# Altium schematic sheet measurment_iq.SchDoc
size A4; SheetNumber: 6; SheetTotal: 7
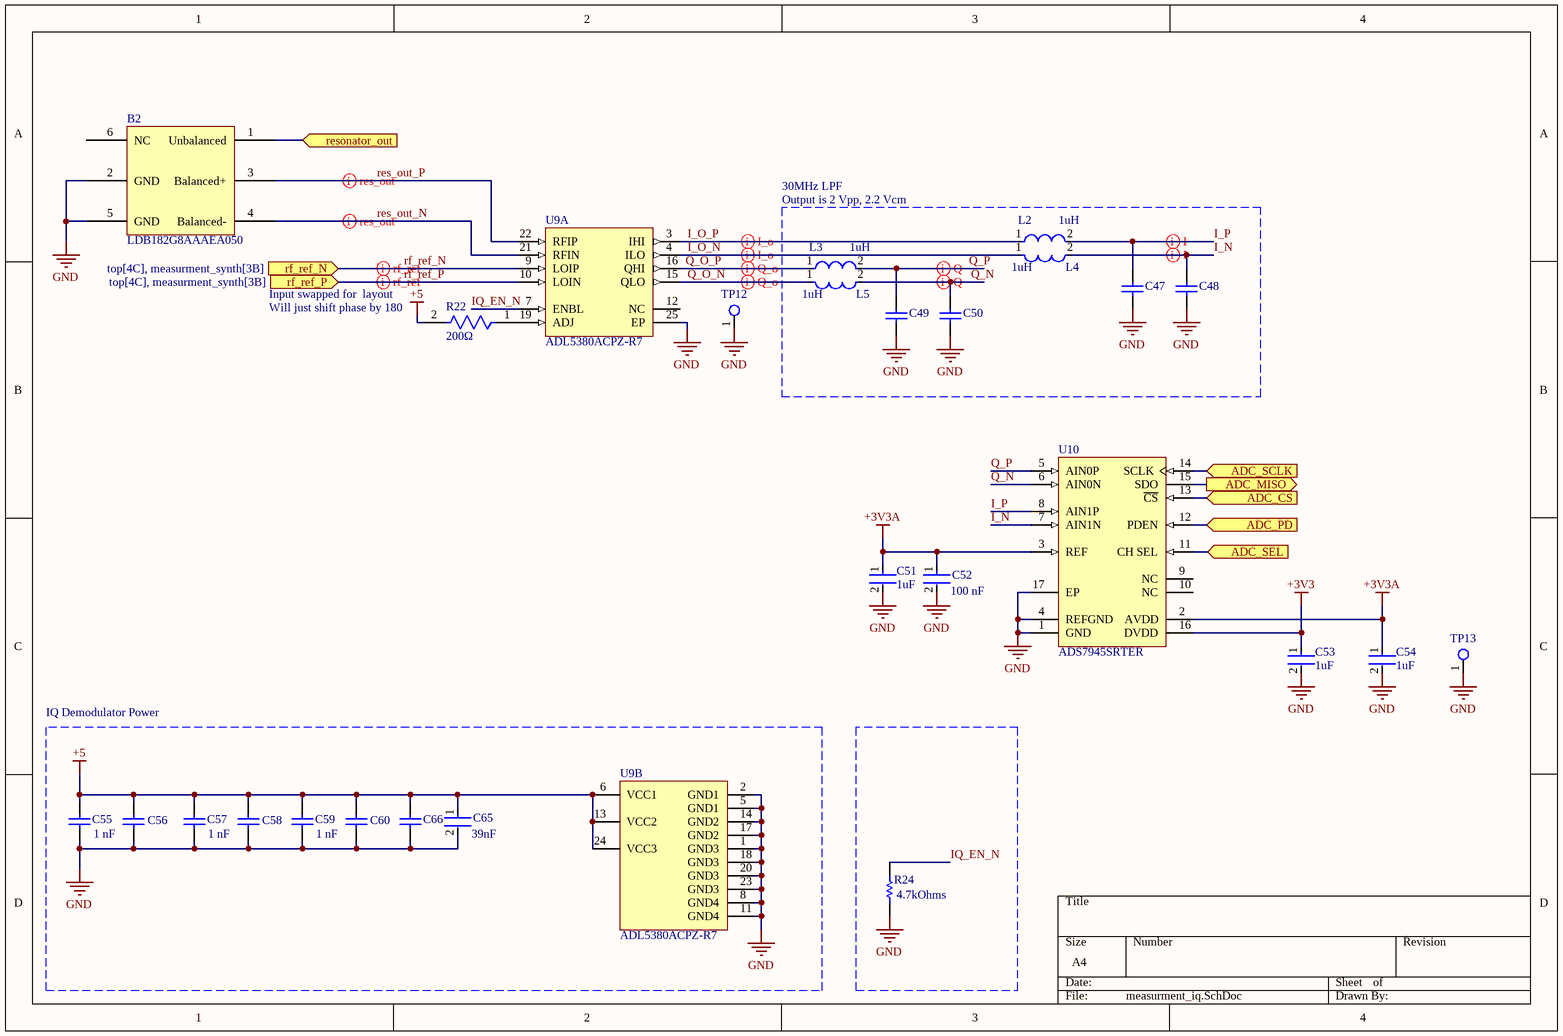
[diagram p0: measurment_iq.SchDoc]

## Parts
B2  LDB182G8AAAEA050  [Balum]
C47  GRM1555C1H270JA01D  [CAPC1005X55X25LL05T10]  (value not drawn)
C48  GRM1555C1H270JA01D  [CAPC1005X55X25LL05T10]  (value not drawn)
C49  GRM1555C1H270JA01D  [CAPC1005X55X25LL05T10]  (value not drawn)
C50  GRM1555C1H270JA01D  [CAPC1005X55X25LL05T10]  (value not drawn)
C51  Capacitance: 1uF  [FP-CL10-IPC_C]  (hidden comment: CL10B105KP8NNNC)
C52  Capacitance: 100 nF  [FP-CC0603-DA-MFG]  (hidden comment: CC0603KRX7R7BB104)
C53  Capacitance: 1uF  [FP-CL10-IPC_C]  (hidden comment: CL10B105KP8NNNC)
C54  Capacitance: 1uF  [FP-CL10-IPC_C]  (hidden comment: CL10B105KP8NNNC)
C55  Capacitance: 1 nF  [CAPC1005X55X25ML5T10]  (hidden comment: GRM155R71H102KA01D)
C56  GRM1555C1H101JA01D  [CAPC1005X55X25ML05T10]  (value not drawn)
C57  Capacitance: 1 nF  [CAPC1005X55X25ML5T10]  (hidden comment: GRM155R71H102KA01D)
C58  GRM1555C1H101JA01D  [CAPC1005X55X25ML05T10]  (value not drawn)
C59  Capacitance: 1 nF  [CAPC1005X55X25ML5T10]  (hidden comment: GRM155R71H102KA01D)
C60  GRM1555C1H101JA01D  [CAPC1005X55X25ML05T10]  (value not drawn)
C65  Capacitance: 39nF  [FP-GCM155-0_05-IPC_B]  (hidden comment: GCM155R71C393KA37D)
C66  GRM1555C1H270JA01D  [CAPC1005X55X25LL05T10]  (value not drawn)
L2  Inductance: 1uH  [FP-LQM21PH_G0-IPC_C]  (hidden comment: LQM21PN1R0NGRD)
L3  Inductance: 1uH  [FP-LQM21PH_G0-IPC_C]  (hidden comment: LQM21PN1R0NGRD)
L4  Inductance: 1uH  [FP-LQM21PH_G0-IPC_C]  (hidden comment: LQM21PN1R0NGRD)
L5  Inductance: 1uH  [FP-LQM21PH_G0-IPC_C]  (hidden comment: LQM21PN1R0NGRD)
R22  value 200Ω  [FP-RT0402-MFG]  (hidden comment: RT0402BRD07200RL)
R24  Resistance: 4.7kOhms  [RESC1608X55X25LL10T15]  (hidden comment: RC0603FR-074K7L)
TP12  Test Point  [test_point]  (value not drawn)
TP13  Test Point  [test_point]  (value not drawn)
U9  ADL5380ACPZ-R7  [ADI-CP-24-3_N]  (parts A,B of 2)
U10  ADS7945SRTER  [TI-RTE16-1700X1700TP_V]

## Blocks framed on the sheet
IQ Demodulator Power: C55-C60 C65 C66 U9

## Ports
ADC_CS (in, see top[3C], mcu[2C]), ADC_MISO (out, see top[3C], mcu[2C]), ADC_PD (in, see top[3C], mcu[2C]), ADC_SCLK (in, see top[3C], mcu[2C]), ADC_SEL (in, see top[3C], mcu[2C]), resonator_out (in, see top[4C]), rf_ref_N (in, see top[4C], measurment_synth[3B]), rf_ref_P (in, see top[4C], measurment_synth[3B])

## Nets
+3V3: C53.1 U10.16(DVDD)
+3V3A: C51.1 C52.1 C54.1 U10.2(AVDD) U10.3(REF)
+5: C55.2 C56.2 C57.2 C58.2 C59.2 C60.2 C65.1 C66.2 R22.2 U9.6(VCC1) U9.13(VCC2) U9.24(VCC3)
GND: B2.2(GND) B2.5(GND) C47.1 C48.1 C49.1 C50.1 C51.2 C52.2 C53.2 C54.2 C55.1 C56.1 C57.1 C58.1 C59.1 C60.1 C65.2 C66.1 R24.1 TP12.1 TP13.1 U9.1(GND3) U9.2(GND1) U9.5(GND1) U9.8(GND4) U9.11(GND4) U9.14(GND2) U9.17(GND2) U9.18(GND3) U9.20(GND3) U9.23(GND3) U9.25(EP) U10.1(GND) U10.4(REFGND) U10.17(EP)
ADC_CS: U10.13(~{CS}) ; port ADC_CS
ADC_MISO: U10.15(SDO) ; port ADC_MISO
ADC_PD: U10.12(PDEN) ; port ADC_PD
ADC_SCLK: U10.14(SCLK) ; port ADC_SCLK
ADC_SEL: U10.11(CH_SEL) ; port ADC_SEL
I_N: C48.2 L4.2 U10.7(AIN1N)
I_O_N: L4.1 U9.4(ILO)
I_O_P: L2.1 U9.3(IHI)
I_P: C47.2 L2.2 U10.8(AIN1P)
IQ_EN_N: R24.2 U9.7(ENBL)
Q_N: C50.2 L5.2 U10.6(AIN0N)
Q_O_N: L5.1 U9.15(QLO)
Q_O_P: L3.1 U9.16(QHI)
Q_P: C49.2 L3.2 U10.5(AIN0P)
res_out_N: B2.4(Balanced-) U9.21(RFIN)
res_out_P: B2.3(Balanced+) U9.22(RFIP)
resonator_out: B2.1(Unbalanced) ; port resonator_out
rf_ref_N: U9.9(LOIP) ; port rf_ref_N
rf_ref_P: U9.10(LOIN) ; port rf_ref_P
NetR22_1: R22.1 U9.19(ADJ)

Not connected (* = marked no-connect by the designer): B2 6(NC); U9 12(NC); U10 9(NC) 10(NC)

## Layout directives
differential pair: I_N, I_O_N, I_O_P, I_P, Q_N, Q_O_N, Q_O_P, Q_P, res_out_N, res_out_P, rf_ref_N, rf_ref_P

## Notes on the sheet
- 30MHz LPF
- Output is 2 Vpp, 2.2 Vcm
- (near R22) Input swapped for  layout
- (near R22) Will just shift phase by 180

## Library data of the parts
C47-C50 C66 = CMP-2008-03917-1: Manufacturer: Murata; Part Number: GRM1555C1H270JA01D
C51 C53 C54 = CMP-2000-06094-2: Cap Ceramic 1uF 10V X7R ±10% Pad SMD 0603 +125°C T/R; Packaging: Tape and Reel; Depth: 0.8mm; Voltage Rating: 10V; Lead Free: Lead Free; Radiation Hardening: No; Length: 1.6mm; Package Quantity: 1; Mount: Surface Mount; Case/Package: 0603; Max Operating Temperature: 125°C; Case Code (Metric): 1608; Height: 0.8mm; Min Operating Temperature: -55°C; Dielectric: X7R; Contact Plating: Tin; Case Code (Imperial): 0603; Thickness: 0.035inch; Voltage Rating (DC): 10V; Tolerance: 10%; Width: 0.031inch
C52 = CMP-2000-05002-2: CAP CER 0.1UF 16V X7R 0603; Manufacturer: YAGEO; Tolerance: 0.1; Value: 100 nF; Temperature Coefficient: 15%; Material: Ceramic; Voltage Rating: 16 V; Package: CC0603-DA; ComponentLink2Description: Datasheet; Octopart: https://octopart.com/cc0603krx7r7bb104-yageo-192941; Temperature Range High: +125°C; Digikey Description: CAP CER 0.1UF 16V X7R 0603; Voltage: 16 V; Device Class L2: Capacitors; Height: 0.9mm; Temperature: -55°C to +125°C; Manufacturer Part Number: CC0603KRX7R7BB104; Device Class L1: Passive Components; Device Class L3: Ceramic Capacitors; ComponentLink2URL: http://www.yageo.com/documents/recent/UPY-GPHC_X7R_6.3V-to-50V_18.pdf; Footprint Url: http://www.yageo.com/exep/pages/download/literatures/UPY-C_GEN_24.pdf; RoHS: TRUE; Temperature Range Low: -55°C; Temperature Characteristic: X7R; Lead Free: Yes; Category: Cap; Mouser Description: Multilayer Ceramic Capacitor, CC Series, 0.1 - F, - 10%, X7R, 16 V, 0603 [1608 Metric]; Automotive: No
C55 C57 C59 = CMP-1662-00017-1: Chip Capacitor, 1 nF, +/- 10%, 50 V, -55 to 125 degC, 0402 (1005 Metric), RoHS, Tape and Reel; Case\/Package: 0402; Type (Capacitors): X7R; Voltage Rating (DC): 50 V; Width: 0.5 mm; Pins: 2; REACH SVHC: No SVHC; Length: 1 mm; Height: 0.5 mm; PackageDescription: 2-Pin Surface Mount Device, Body 1 x 0.5 mm; DatasheetVersion: 07/2016; Mount: Surface Mount; ComponentLink2Description: Datasheet; Tolerance: 10%; ComponentLink2URL: http://psearch.en.murata.com/capacitor/product/GRM155R71H102KA01%23.pdf; ComponentLink1URL: http://www.murata.com/; Case Code (Metric): 1005; Package Quantity: 10000; Min Operating Temperature: -55 degC; Max Operating Temperature: 125 degC; Voltage Rating: 50 V; ComponentLink1Description: Manufacturer URL; Packaging: Tape and Reel; Radiation Hardening: No; RoHSCompliant: true; PackageReference: 0402; Mounting Technology: Surface Mount; Case Code (Imperial): 0402
C56 C58 C60 = CMP-2008-03915-1: Manufacturer: Murata; Part Number: GRM1555C1H101JA01D
C65 = CMP-06035-054841-1: Ceramic Capacitor for Automotive 39nF ±10% 16VDC X7R 0402 Paper T/R; Voltage Rating: 16V; Max Operating Temperature: 125°C; Case Code (Imperial): 0402; Mount: Surface Mount; Packaging: Cut Tape; Tolerance: 10%; Min Operating Temperature: -55°C; Ratings: AEC-Q200; Case Code (Metric): 1005; Case/Package: 0402
L2-L5 = CMP-06042-017027-1: Multilayer Type Inductor for Power Lines, 0805 (2012), 1μH, 30%, 0.0825Ω, 1.3A; Test Frequency: 1MHz; Shielding: Shielded; Self Resonant Frequency: 50MHz; DC Resistance (DCR): 82.5mR; Core Material: Ferrite; Inductance Tolerance: 30%; Military Standard: Not; Height - Seated (Max): 0.039inch; Max DC Current: 1.3A; Depth: 1.4mm; Packaging: Tape and Reel; Mount: Surface Mount; Width: 0.049inch; Case Code (Imperial): 0805; RoHS Compliant: Yes; Height: 0.9mm; Case/Package: 0805; Max Operating Temperature: 125°C; Min Operating Temperature: -55°C; REACH SVHC: No SVHC; DC Current: 1.3A; Current Rating: 1.3A; Weight: 0.000194oz; Case Code (Metric): 2012; Termination: SMD/SMT; Length: 2mm; Series: LQM21PN_GR; Tolerance: 30%; Package Quantity: 4000
R22 = CMP-03412-023045-1: RES SMD 200 OHM 0.1% 1/16W 0402; Manufacturer: Yageo; Tolerance: 0.001; Voltage Rating: 50V; Temperature Coefficient: 25 ppm/°C; Power Rating: 0.063W; Device Class L2: Resistors; RoHS: TRUE; Series: RT; Resistance: 200Ω; Mouser Description: Thin Film Resistors - SMD 1/16W 200 ohm .1% 25ppm; Manufacturer Part Number: RT0402BRD07200RL; Footprint Url: http://www.yageo.com/exep/pages/download/literatures/PYu-R_Mount_10.pdf; ComponentLink2URL: http://www.yageo.com/documents/recent/PYu-RT_1-to-0.01_RoHS_L_9.pdf; Device Class L1: Passive Components; Height: 0.35mm; Temperature: -55°C to +155°C; Temperature Range High: +155°C; Package: RT0402; Device Class L3: Chip SMD Resistors; Lead Free: Yes; Ipc Land Pattern Name: RESC10050X30; Category: Res; Digikey Description: RES SMD 200 OHM 0.1% 1/16W 0402; Automotive: No; ComponentLink2Description: Datasheet; Composition: Thin Film; Temperature Range Low: -55°C; Octopart: https://octopart.com/rt0402brd07200rl-yageo-1238579
R24 = CMP-2000-06942-1: Chip Resistor, 4.7 KOhm, +/- 1%, 0.1 W, -55 to 155 degC, 0603 (1608 Metric), RoHS, Tape and Reel; Manufacturer: Yageo; Power Rating: 100mW; Temperature Coefficient: 100PPM/C; Voltage Rating: 50V; Package Reference: 0603; Series: RC; Datasheet Version: Rev. 7, 05/2017; Packaging: Reel; Termination Style: SMD/SMT; Datasheet URL: http://www.yageo.com/documents/recent/PYu-RC_Group_51_RoHS_L_7.pdf; Manufacturer URL: http://www.yageo.com/; Package Description: 2-Pin Surface Mount Device, Body 1.6 x 0.8 mm; Case Code - mm: 1608; Case Code - in: 0603; Mounting Technology: SurfaceMount; Operating Temperature Range: -55Cto+155C; Tolerance: 1%; Product: ThickFilmResistorsGeneralPurpose
U9 = CMP-0285-00050-1: 400 MHz to 6 GHz Quadrature Demodulator, CP-24-3, Pb-Free, 1500 Reel; Min RF Frequency (MHz): 400MHz; Output P1dB (dBm): 12; IQ Freq (MHz): 390MHz; Max RF Frequency (MHz): 6GHz; Amplitude Error (dB): 70mdB; IIP3 (+dBm): 22dBm; Phase Error (deg): 0.2Deg; ComponentLink1Description: Manufacturer URL; ComponentLink3URL: http://www.analog.com/static/imported-files/packages/56702234806764CP_24_3.pdf; DatasheetVersion: Rev. 0; PackageReference: CP-24-3; ComponentLink2Description: Datasheet; ComponentLink1URL: www.analog.com; ComponentLink2URL: http://www.analog.com/static/imported-files/data_sheets/ADL5380.pdf; PackageVersion: Jan-2005; PackageDescription: 24-Lead Lead Frame Chip Scale Package [LFCSP_VQ]; ComponentLink3Description: Package Specification; Code_JEDEC: MO-220-VGGD-8
U10 = CMP-0003-02161-1: 14-Bit, 2 MSPS, Dual-Channel, Unipolar, Differential, u-Power SAR ADC, -40 to 85 degC, 16-pin QFN (RTE16), Green (RoHS & no Sb/Br); Manufacturer: Texas Instruments; SFDR(dB): 94; Digital Supply(Max)(V): 5.25; Interface: Serial SPI; SNR(dB): 84; Analog Voltage AV/DD(Min)(V): 2.7; SINAD(dB): 83.5; SubFamily: Precision ADC (<=10MSPS); INL(Max)(+/-LSB): 1.5; Resolution(Bits): 14; Digital Supply(Min)(V): 1.65; # Input Channels: 2; Sample Rate (max)(SPS): 2M; ComponentLink2URL: http://www.ti.com/general/docs/lit/getliterature.tsp?genericPartNumber=ADS7945&fileType=pdf; ComponentLink3Description: Package Specification; PackageReference: RTE16-1700X1700TP; PackageVersion: 4205254/D, 01/2011; Analog Voltage AV/DD(Max)(V): 5.25; Code_JEDEC: MO-220; Architecture: SAR; ComponentLink1URL: http://www.ti.com/; ComponentLink2Description: Datasheet; Eco-Plan: Green (RoHS & no Sb/Br); ComponentLink1Description: Manufacturer URL; DatasheetVersion: SBAS539B; PackageDescription: 16-Pin Plastic Flat Pack, Body 3 x 3 mm, Pitch 0.5 mm; PartNumber: ADS7945SRTER; Mounting Technology: Surface Mount; ComponentLink3URL: http://www.ti.com/litv/pdf/mpqf149c